# Altium schematic sheet board_back.SchDoc
size A4
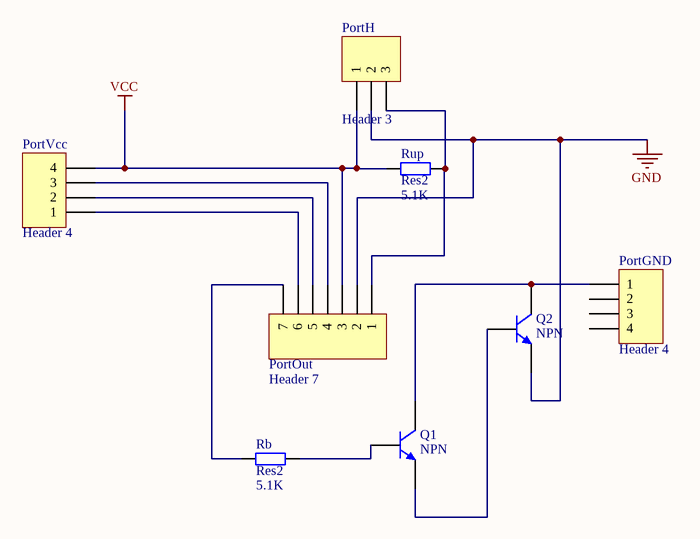
[diagram p0: board_back.SchDoc]

## Parts
PortGND  Header 4  [HDR1X4]
PortH  Header 3  [HDR1X3]
PortOut  Header 7  [HDR1X7]
PortVcc  Header 4  [HDR1X4]
Q1  NPN  [TO-226-AA]
Q2  NPN  [TO-226-AA]
Rb  Res2  value 5.1K  [AXIAL-0.4]
Rup  Res2  value 5.1K  [AXIAL-0.4]

## Nets
GND: PortH.2 PortOut.2 Q2.3(E)
VCC: PortH.1 PortOut.3 PortVcc.4 Rup.1
NetPortGND_1: PortGND.1 Q1.1(C) Q2.1(C)
NetPortH_3: PortH.3 PortOut.1 Rup.2
NetPortOut_4: PortOut.4 PortVcc.3
NetPortOut_5: PortOut.5 PortVcc.2
NetPortOut_6: PortOut.6 PortVcc.1
NetPortOut_7: PortOut.7 Rb.1
NetQ1_2: Q1.2(B) Rb.2
NetQ1_3: Q1.3(E) Q2.2(B)

Not connected (* = marked no-connect by the designer): PortGND 2 3 4

## Library data of the parts
PortGND PortVcc = Header 4: Header, 4-Pin; LatestRevisionDate: 17-Jul-2002; LatestRevisionNote: Re-released for DXP Platform.; Publisher: Altium Limited
PortH = Header 3: Header, 3-Pin; LatestRevisionDate: 17-Jul-2002; LatestRevisionNote: Re-released for DXP Platform.; Publisher: Altium Limited
PortOut = Header 7: Header, 7-Pin; LatestRevisionDate: 17-Jul-2002; LatestRevisionNote: Re-released for DXP Platform.; Publisher: Altium Limited
Q1 Q2 = NPN: NPN Bipolar Transistor; Published: 8-Jun-2000; LatestRevisionDate: 17-Jul-2002; LatestRevisionNote: Re-released for DXP Platform.; PackageReference: TO-226-AA; Publisher: Altium Limited; PackageDescription: TO, Flat Index; 3 In-Line, Axial Leads; Body Dia. 4.8mm; Leads 0.55 x 0.51 mm (max); Code_JEDEC: TO-226-AA
Rb Rup = Res2: Resistor; Published: 8-Jun-2000; LatestRevisionDate: 17-Jul-2002; LatestRevisionNote: Re-released for DXP Platform.; PackageReference: AXIAL-0.4; Publisher: Altium Limited; PackageDescription: Axial Device, Thru-Hole; 2 Leads; 0.4 in Pin Spacing